# EAGLE design MTRduino_Rev1.0 (EAGLE 7.0.0)
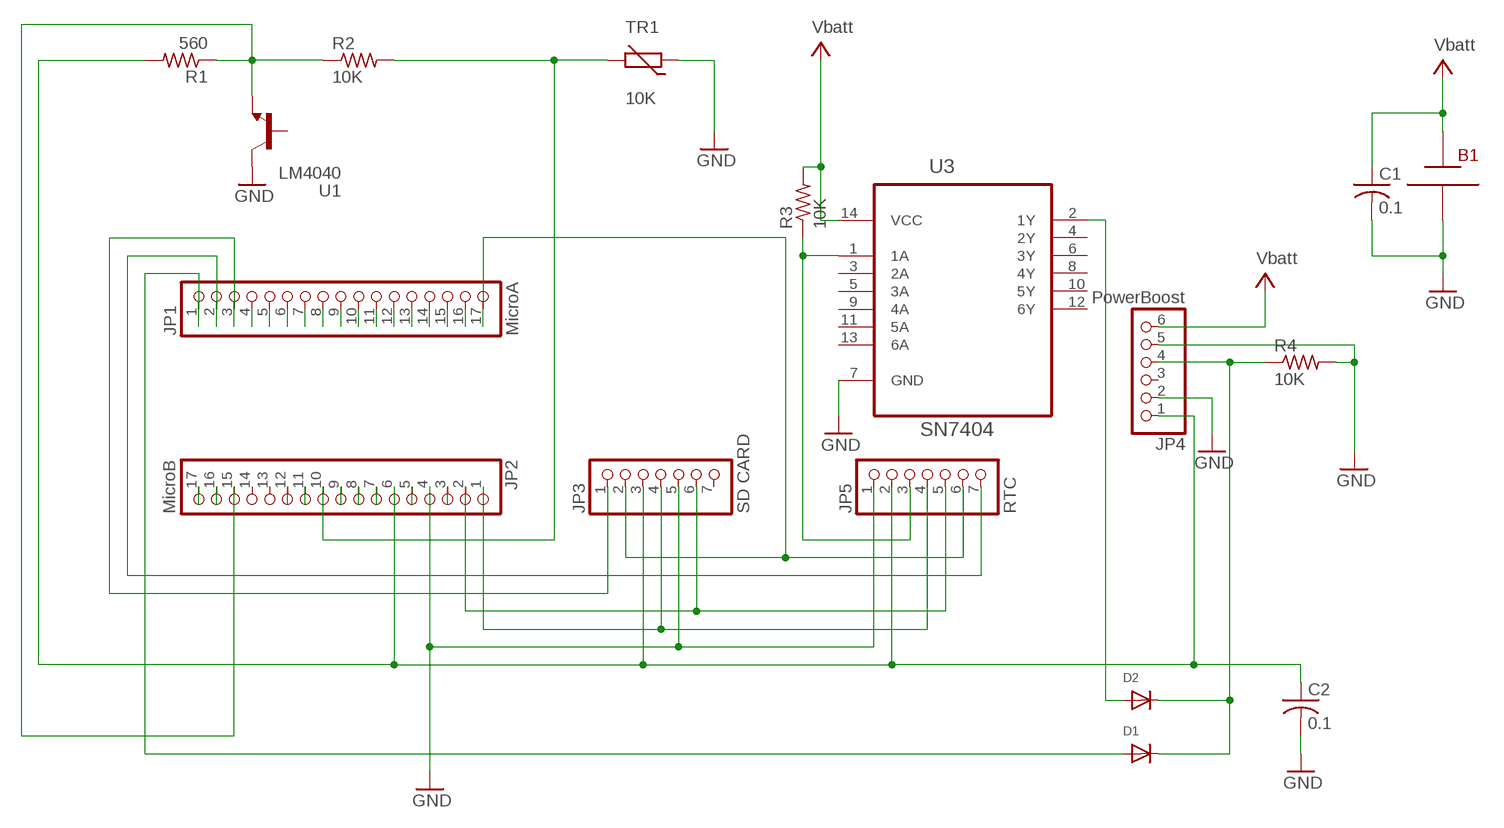
[diagram p0: schematic, sheet 1]

## Parts
B1  AA Batt  BATT_AA2  [BATT_AA2]
C1  0.1  C-US025-030X050  [C025-030X050]
C2  0.1  C-US025-030X050  [C025-030X050]
D1  DIODEDO-1N4148  [DO-1N4148]
D2  DIODEDO-1N4148  [DO-1N4148]
JP1  MicroA  PINHD-1X17  [1X17]
JP2  MicroB  PINHD-1X17  [1X17]
JP3  SD CARD  PINHD-1X7  [1X07]
JP4  PowerBoost  PINHD-1X6  [1X06]
JP5  RTC  PINHD-1X7  [1X07]
R1  560  R-US_0207/12  [0207/12]
R2  10K  R-US_0207/12  [0207/12]
R3  10K  R-US_0207/12  [0207/12]
R4  10K  R-US_0207/12  [0207/12]
TR1  10K  THERMISTOR-5  [R-5]
U1  LM4040  -NPN-TO92-BEC  [TO92-BEC]
U3  SN7404  SN74AC04N  [DIP254P762X508-14]

## Nets
GND: B1.- C1.2 C2.2 JP2.4 JP3.5 JP4.2 JP4.5 JP5.1 R4.2 TR1.1 U1.C U3.7(GND)
N$1: D2.A U3.2(1Y)
N$3: JP1.2 JP5.7
N$4: JP1.4
N$5: JP1.5
N$6: JP5.3 R3.1 U3.1(1A)
N$7: JP1.7
N$8: JP1.8
N$9: JP1.9
N$10: JP1.10
N$11: JP1.11
N$12: JP1.12
N$13: JP1.13
N$14: JP1.14
N$15: JP1.15
N$16: JP1.16
N$18: JP1.17 JP3.2 JP5.6
N$19: JP1.6
N$20: JP2.3
N$21: D1.A JP1.1
N$22: JP2.5
N$24: JP2.7
N$25: JP2.8
N$26: JP2.9
N$27: JP2.10 R2.2 TR1.2
N$28: JP2.11
N$29: JP2.12
N$31: D1.C D2.C JP4.4 R4.1
N$33: JP2.16
N$34: JP2.17
N$36: JP2.15 R1.1 R2.1 U1.E
N$37: JP2.1 JP3.4 JP5.4
N$39: JP2.2 JP3.6 JP5.5
N$40: C2.1 JP2.6 JP3.3 JP4.1 JP5.2 R1.2
N$41: JP1.3 JP3.1
V+: B1.+ C1.1 JP4.6 R3.2 U3.14(VCC) ; supply symbol labelled Vbatt
Unconnected: JP2.13 JP2.14 JP3.7 JP4.3 U1.B U3.3(2A) U3.4(2Y) U3.5(3A) U3.6(3Y) U3.8(4Y) U3.9(4A) U3.10(5Y) U3.11(5A) U3.12(6Y) U3.13(6A)

## Library data of the parts
B1 = adafruit:BATT_AA2
C1 C2 = adafruit:C-US: CAPACITOR, American symbol
D1 D2 = adafruit:DIODE: Diode SMADIODE - SMA Surface Mount Package 20V 1A Schottky Diode Digikey: 641-1014-6-ND DO-1N4148 - Through Hole Small Current Diode SOD-123 20V 1 A (.5mV Vf) Schottky Diode - Digikey: MBRX120TPMSCT-ND SOD-323 10V 570mA (.38mV Vf, 3ns) Schottky Diode - Digikey: ZLLS410CT-ND SOD-523 30V 30mA Schottky Diode (RB751S-40TE61) - Digikey: RB751S-40TE61CT-ND SOT23-R/W - SOT23 Package (R = Solder Paste/Reflow Ovens, W = Hand-Soldering) BAT54Film 40V 300mA - Digikey: 497-7162-1-ND
JP1 JP2 = pinhead:PINHD-1X17: PIN HEADER
JP3 JP5 = pinhead:PINHD-1X7: PIN HEADER
JP4 = pinhead:PINHD-1X6: PIN HEADER
R1-R4 = rcl:R-US_: RESISTOR, American symbol
TR1 = varistor:THERMISTOR: THERMISTOR
U1 = transistor-neu-to92:*-NPN-: NPN Transistror
U3 = Texas Instruments_By_element14_Batch_1:SN74AC04N: IC HEX INVERTER; MPN: SN74AC04N; OC_FARNELL: 1739963; OC_NEWARK: 52F2307; PACKAGE: 14-DIP; SUPPLIER: Texas Instruments

## Board
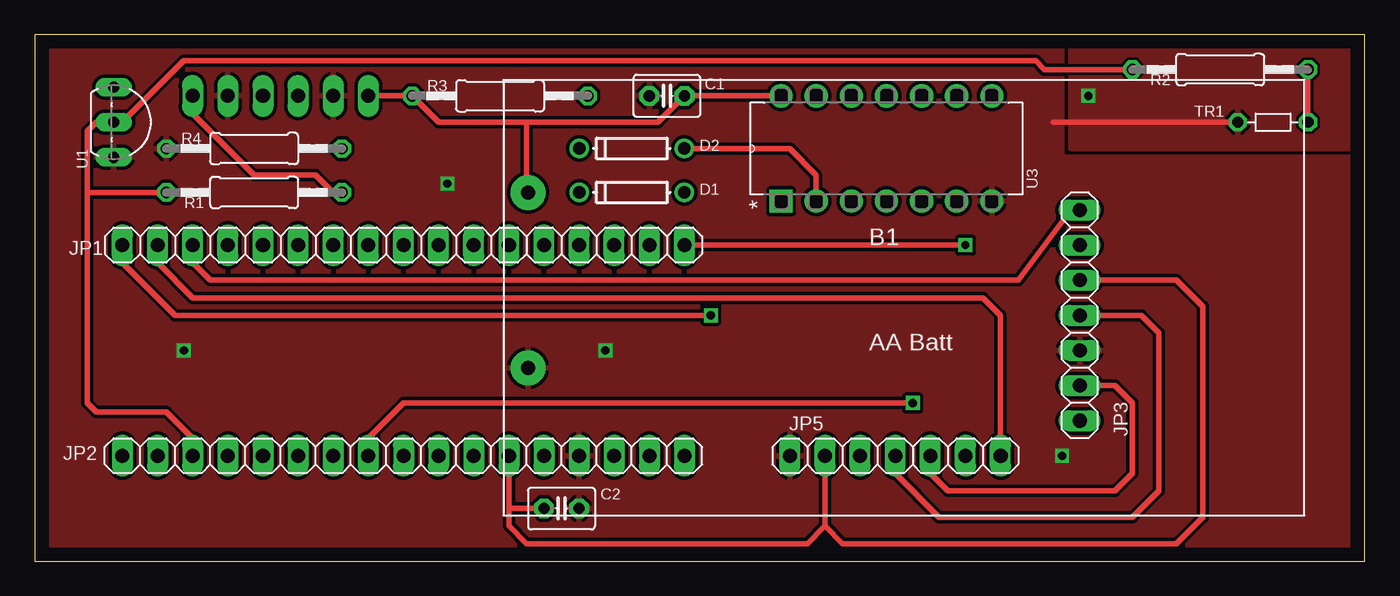
[diagram p1: board, top side]
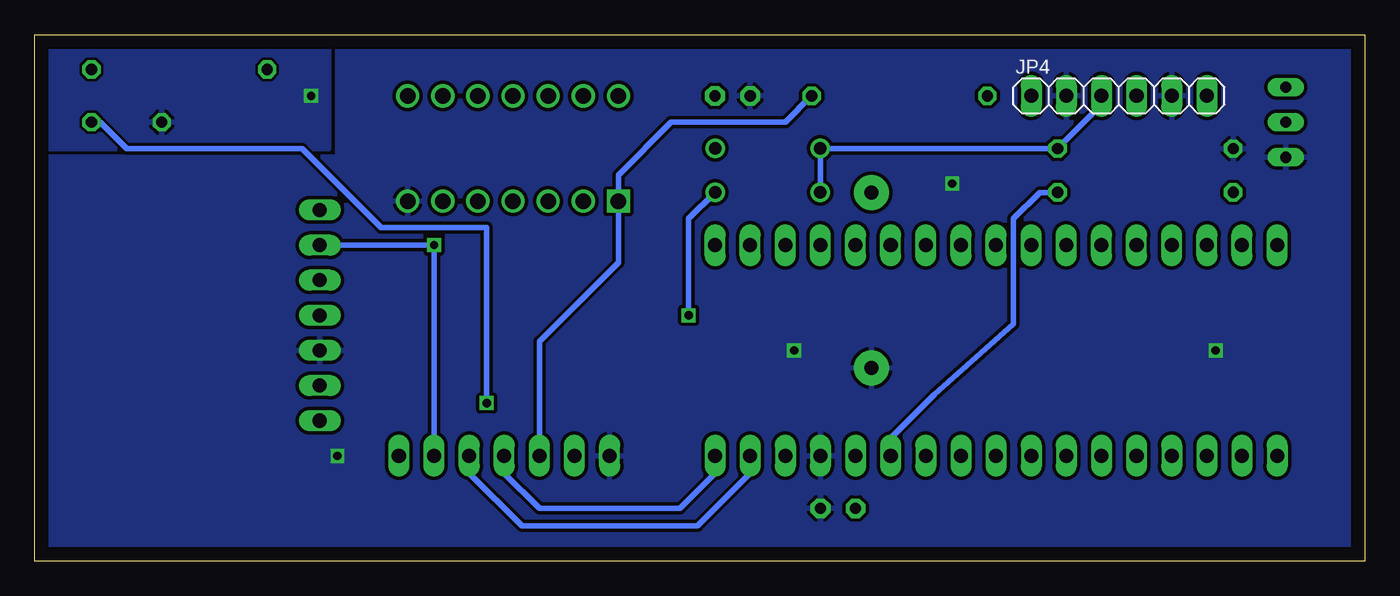
[diagram p2: board, bottom side, seen from below]

Size 96.19 x 38.09 mm. Coordinates in mm from the lower left corner, seen from the top.
Outline: 0,0 96.19,0 96.19,38.09 0,38.09 0,0
Copper layers (1*16): Top 0.035mm / dielectric 1.5mm / Bottom 0.035mm
Design rules "default *": minimum track width 10mil, minimum drill 20mil, track to track 8mil, track to pad 8mil, pad to pad 8mil, via to via 8mil, smd to smd 8mil, copper to edge 40mil, drill to drill 8mil, minimum pad ring 10mil, minimum via ring 8mil, stop-mask expansion 4mil, vias tented up to drill 0mil, thermal gap 10mil

### Footprints (pad centres in the part's own frame; a part is rotated, then mirrored left to right if it is on the bottom)
BATT_AA2 = drill 1 pad 2.54: + -27.178,7.62; - -27.178,-5.08
C025-030X050 = drill 0.813 pad 1.422 octagon: 1 -1.27,0; 2 1.27,0
DO-1N4148 = drill 0.9: A -3.81,0; C 3.81,0
1X17 = drill 1.016 long: 1 -20.32,0; 2 -17.78,0; 3 -15.24,0; 4 -12.7,0; 5 -10.16,0; 6 -7.62,0; 7 -5.08,0; 8 -2.54,0; 9 0,0; 10 2.54,0; 11 5.08,0; 12 7.62,0; 13 10.16,0; 14 12.7,0; 15 15.24,0; 16 17.78,0; 17 20.32,0
1X07 = drill 1.016 long: 1 -7.62,0; 2 -5.08,0; 3 -2.54,0; 4 0,0; 5 2.54,0; 6 5.08,0; 7 7.62,0
1X06 = drill 1.016 long: 1 -6.35,0; 2 -3.81,0; 3 -1.27,0; 4 1.27,0; 5 3.81,0; 6 6.35,0
0207/12 = drill 0.813 octagon: 1 -6.35,0; 2 6.35,0
R-5 = drill 0.813 octagon: 1 -2.54,0; 2 2.54,0
TO92-BEC = drill 0.813 long: B -2.54,0; C 2.54,0; E 0,0
DIP254P762X508-14 = drill 1.118 square: 1 -7.62,15.24 | drill 1.118: 2 -7.62,12.7; 3 -7.62,10.16; 4 -7.62,7.62; 5 -7.62,5.08; 6 -7.62,2.54; 7 -7.62,0; 8 0,0; 9 0,2.54; 10 0,5.08; 11 0,7.62; 12 0,10.16; 13 0,12.7; 14 0,15.24

### Placement (x,y rotation side)
B1  62.87,19.05 0 top
C1  45.72,33.66 180 top
C2  38.1,3.81 0 top
D1  43.18,26.67 180 top
D2  43.18,29.84 180 top
JP1  26.67,22.86 0 top
JP2  26.67,7.62 180 top
JP3  75.56,17.78 270 top
JP4  17.78,33.66 180 bottom
JP5  62.23,7.62 0 top
R1  15.88,26.67 0 top
R2  85.72,35.56 0 top
R3  33.66,33.66 180 top
R4  15.88,29.84 180 top
TR1  89.53,31.75 0 top
U1  5.71,31.75 270 top
U3  69.21,33.66 90 top

### Tracks (layer width: path | path; a pad name or v marks a point on that pad's centre or on a via)
GND  (via drill 0.6)
  Top 0.406: TR1.1 73.66,31.75
  other vias: 76.2,33.66 74.3,7.62 10.79,15.24 29.84,27.3 41.28,15.24
  pour Bottom (isolate 0.254): -1.27,39.37 -1.27,-1.91 98.42,-1.91 98.42,29.21 74.3,29.21 74.3,39.37
  pour Top (isolate 0.254): -2.54,-3.17 98.42,-3.17 98.42,29.21 74.3,29.21 74.3,39.37 -2.54,39.37
  pour Bottom: 74.93,39.37 74.93,29.84 98.42,29.84 98.42,39.37
  pour Top: 74.93,38.73 74.93,29.84 98.42,29.84 98.42,38.73
N$1
  Top 0.406: U3.2 56.52,27.94 54.61,29.84 D2.A
N$3
  Top 0.406: JP5.7 69.85,17.78 68.58,19.05 11.43,19.05 8.89,21.59 JP1.2
N$6
  Bottom 0.406: JP5.3 59.69,15.88 53.98,21.59 U3.1 53.98,27.94 50.17,31.75 41.91,31.75 R3.1
N$18  (via drill 0.6)
  Top 0.406: JP1.17 v67.31,22.86
  Bottom 0.406: JP3.2 v67.31,22.86 JP5.6
N$21  (via drill 0.6)
  Top 0.406: JP1.1 6.35,21.59 10.16,17.78 v48.9,17.78
  Bottom 0.406: D1.A 48.9,24.77 v48.9,17.78
N$27  (via drill 0.6)
  Top 0.406: JP2.10 24.13,8.89 26.67,11.43 v63.5,11.43 | R2.2 TR1.2
  Bottom 0.406: v63.5,11.43 63.5,24.13 71.12,24.13 76.83,29.84 89.53,29.84 91.44,31.75 TR1.2
N$31
  Bottom 0.406: JP4.4 19.05,33.02 R4.1 D2.C D1.C
N$36
  Top 0.406: 3.81,26.67 3.81,31.11 4.45,31.75 U1.E 6.35,31.75 10.79,36.2 72.39,36.2 73.02,35.56 R2.1 | 3.81,26.67 3.81,11.43 4.45,10.79 9.53,10.79 11.43,8.89 JP2.15 | R1.1 3.81,26.67
N$37
  Top 0.406: JP3.4 80.01,17.78 81.28,16.51 81.28,5.08 79.38,3.17 65.41,3.17 62.23,6.35 JP5.4
  Bottom 0.406: JP5.4 62.23,6.35 59.69,3.81 49.53,3.81 46.99,6.35 JP2.1
N$39
  Top 0.406: JP3.6 78.1,12.7 79.38,11.43 79.38,6.35 78.1,5.08 66.04,5.08 64.77,6.35 JP5.5
  Bottom 0.406: JP5.5 64.77,6.35 60.96,2.54 48.26,2.54 44.45,6.35 JP2.2
N$40
  Top 0.406: JP2.6 34.29,3.81 | 34.29,3.81 34.29,2.54 35.56,1.27 55.88,1.27 57.15,2.54 | 57.15,2.54 JP5.2 | JP3.3 82.55,20.32 84.45,18.41 84.45,3.17 82.55,1.27 58.42,1.27 57.15,2.54 | R1.2 21.59,26.67 20.32,27.94 15.88,27.94 11.43,32.38 JP4.1 | C2.1 34.29,3.81
  Bottom 0.406: JP2.6 34.29,8.89 31.11,12.06 25.4,17.14 25.4,24.77 23.5,26.67 R1.2
N$41
  Top 0.406: JP3.1 74.93,25.4 71.12,20.32 12.7,20.32 11.43,21.59 JP1.3
V+
  Top 0.406: U3.14 C1.1 45.09,31.75 35.56,31.75 | JP4.6 R3.2 29.21,31.75 35.56,31.75 | B1.+ 35.56,26.67 35.56,31.75

### Text on the board
tValues: CS | DI | VCC | 12 | 11 | 10 | 9 | 8 | 7 | 6 | 5 | 4 | 3 | 2 | RS | RX | TX | SS | GND | SCK | MOSI | GND | DO | CD | 13 | 3V | AREF | A0 | A1 | A2 | A3 | A4 | A5 | NC | NC | +5V | RS | GND | VIN | SCK | MISO | SS | GND | VCC | CLK | SQW | MISO | MOSI
bValues: 5V | LB | EN | GND | GND | BAT